# Altium project DIO-SMA16-DIOT.PrjPCB (part 4 of 4)

## Sheet DIOT_SMA_Supply.SchDoc: DIO-SMA
size 420 x 297 mm; Author: G.Kasprowicz; CompanyName: WUT ISE; DrawnBy: G.Kasprowicz; Organization: WUT ISE; Address1: PW ISE; Address2: Nowowiejska 15/19 00-665 Warsaw; Address3: gkasprow@gmail.com; DocumentNumber: 2; Revision: 1.1; SheetNumber: 2; SheetTotal: 2; ModifiedBy: -; CheckedDate: -; Title2: v1.1; DivGrp: WUT ISE; Designer: G.Kasprowicz; ModifiedDate: -; ProjectName: Sensor Box
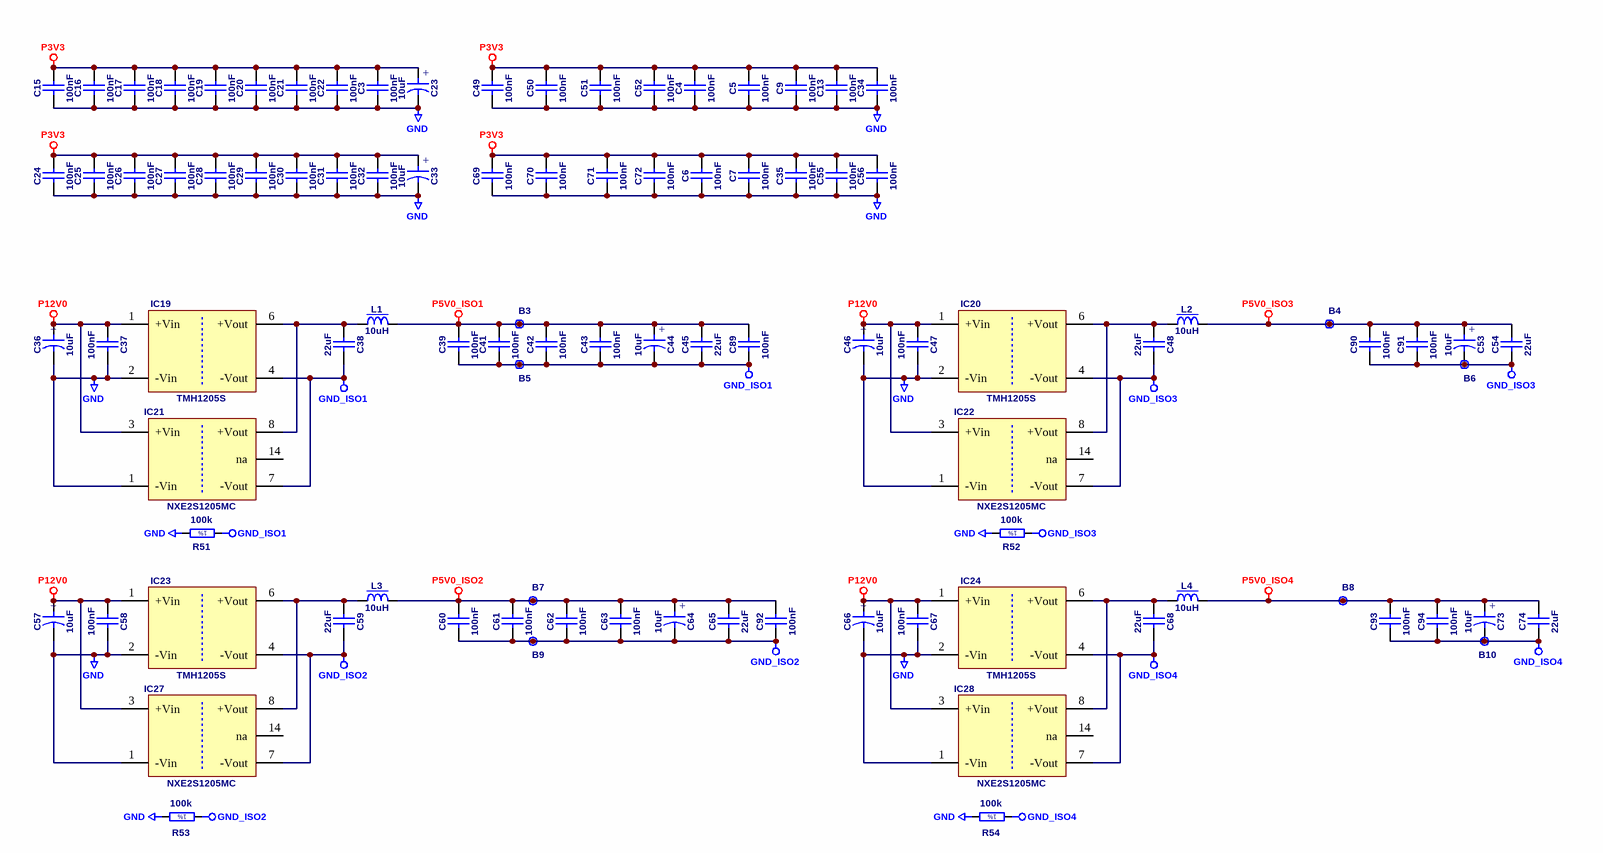
[diagram p9: DIOT_SMA_Supply.SchDoc]

### Parts
B3  Plated Hole  [c130h60]  (value not drawn)  (no BOM)
B4  Plated Hole  [c130h60]  (value not drawn)  (no BOM)
B5  Plated Hole  [c130h60]  (value not drawn)  (no BOM)
B6  Plated Hole  [c130h60]  (value not drawn)  (no BOM)
B7  Plated Hole  [c130h60]  (value not drawn)  (no BOM)
B8  Plated Hole  [c130h60]  (value not drawn)  (no BOM)
B9  Plated Hole  [c130h60]  (value not drawn)  (no BOM)
B10  Plated Hole  [c130h60]  (value not drawn)  (no BOM)
C3  100nF  [CAPC1005X55N]
C4  100nF  [CAPC1005X55N]
C5  100nF  [CAPC1005X55N]
C6  100nF  [CAPC1005X55N]
C7  100nF  [CAPC1005X55N]
C9  100nF  [CAPC1005X55N]
C13  100nF  [CAPC1005X55N]
C15  100nF  [CAPC1005X55N]
C16  100nF  [CAPC1005X55N]
C17  100nF  [CAPC1005X55N]
C18  100nF  [CAPC1005X55N]
C19  100nF  [CAPC1005X55N]
C20  100nF  [CAPC1005X55N]
C21  100nF  [CAPC1005X55N]
C22  100nF  [CAPC1005X55N]
C23  10uF  [CAPAE430X540N]
C24  100nF  [CAPC1005X55N]
C25  100nF  [CAPC1005X55N]
C26  100nF  [CAPC1005X55N]
C27  100nF  [CAPC1005X55N]
C28  100nF  [CAPC1005X55N]
C29  100nF  [CAPC1005X55N]
C30  100nF  [CAPC1005X55N]
C31  100nF  [CAPC1005X55N]
C32  100nF  [CAPC1005X55N]
C33  10uF  [CAPAE430X540N]
C34  100nF  [CAPC1005X55N]
C35  100nF  [CAPC1005X55N]
C36  10uF  [CAPAE430X540N]
C37  100nF  [CAPC1005X55N]
C38  22uF  [CAPC2012X135N]
C39  100nF  [CAPC1005X55N]
C41  100nF  [CAPC1005X55N]
C42  100nF  [CAPC1005X55N]
C43  100nF  [CAPC1005X55N]
C44  10uF  [CAPAE430X540N]
C45  22uF  [CAPC2012X135N]
C46  10uF  [CAPAE430X540N]
C47  100nF  [CAPC1005X55N]
C48  22uF  [CAPC2012X135N]
C49  100nF  [CAPC1005X55N]
C50  100nF  [CAPC1005X55N]
C51  100nF  [CAPC1005X55N]
C52  100nF  [CAPC1005X55N]
C53  10uF  [CAPAE430X540N]
C54  22uF  [CAPC2012X135N]
C55  100nF  [CAPC1005X55N]
C56  100nF  [CAPC1005X55N]
C57  10uF  [CAPAE430X540N]
C58  100nF  [CAPC1005X55N]
C59  22uF  [CAPC2012X135N]
C60  100nF  [CAPC1005X55N]
C61  100nF  [CAPC1005X55N]
C62  100nF  [CAPC1005X55N]
C63  100nF  [CAPC1005X55N]
C64  10uF  [CAPAE430X540N]
C65  22uF  [CAPC2012X135N]
C66  10uF  [CAPAE430X540N]
C67  100nF  [CAPC1005X55N]
C68  22uF  [CAPC2012X135N]
C69  100nF  [CAPC1005X55N]
C70  100nF  [CAPC1005X55N]
C71  100nF  [CAPC1005X55N]
C72  100nF  [CAPC1005X55N]
C73  10uF  [CAPAE430X540N]
C74  22uF  [CAPC2012X135N]
C89  100nF  [CAPC1005X55N]
C90  100nF  [CAPC1005X55N]
C91  100nF  [CAPC1005X55N]
C92  100nF  [CAPC1005X55N]
C93  100nF  [CAPC1005X55N]
C94  100nF  [CAPC1005X55N]
IC19  TMH1205S  [DCDC_TRACO_TMA]
IC20  TMH1205S  [DCDC_TRACO_TMA]
IC21  NXE2S1205MC  [DCDC_MURATA_NXE2]
IC22  NXE2S1205MC  [DCDC_MURATA_NXE2]
IC23  TMH1205S  [DCDC_TRACO_TMA]
IC24  TMH1205S  [DCDC_TRACO_TMA]
IC27  NXE2S1205MC  [DCDC_MURATA_NXE2]
IC28  NXE2S1205MC  [DCDC_MURATA_NXE2]
L1  10uH  [IND_MURATA-PS_8400]
L2  10uH  [IND_MURATA-PS_8400]
L3  10uH  [IND_MURATA-PS_8400]
L4  10uH  [IND_MURATA-PS_8400]
R51  100k  [RESC2012X60N]
R52  100k  [RESC2012X60N]
R53  100k  [RESC2012X60N]
R54  100k  [RESC2012X60N]

### Nets
GND: C3.1 C4.1 C5.1 C6.1 C7.1 C9.1 C13.1 C15.1 C16.1 C17.1 C18.1 C19.1 C20.1 C21.1 C22.1 C23.2 C24.1 C25.1 C26.1 C27.1 C28.1 C29.1 C30.1 C31.1 C32.1 C33.2 C34.1 C35.1 C36.2 C37.1 C46.2 C47.1 C49.1 C50.1 C51.1 C52.1 C55.1 C56.1 C57.2 C58.1 C66.2 C67.1 C69.1 C70.1 C71.1 C72.1 IC19.2(-Vin) IC20.2(-Vin) IC21.1(-Vin) IC22.1(-Vin) IC23.2(-Vin) IC24.2(-Vin) IC27.1(-Vin) IC28.1(-Vin) R51.2 R52.2 R53.2 R54.2
GND_ISO1: B5.1 C38.1 C39.1 C41.1 C42.1 C43.1 C44.2 C45.1 C89.1 IC19.4(-Vout) IC21.7(-Vout) R51.1
GND_ISO2: B9.1 C59.1 C60.1 C61.1 C62.1 C63.1 C64.2 C65.1 C92.1 IC23.4(-Vout) IC27.7(-Vout) R53.1
GND_ISO3: B6.1 C48.1 C53.2 C54.1 C90.1 C91.1 IC20.4(-Vout) IC22.7(-Vout) R52.1
GND_ISO4: B10.1 C68.1 C73.2 C74.1 C93.1 C94.1 IC24.4(-Vout) IC28.7(-Vout) R54.1
P3V3: C3.2 C4.2 C5.2 C6.2 C7.2 C9.2 C13.2 C15.2 C16.2 C17.2 C18.2 C19.2 C20.2 C21.2 C22.2 C23.1 C24.2 C25.2 C26.2 C27.2 C28.2 C29.2 C30.2 C31.2 C32.2 C33.1 C34.2 C35.2 C49.2 C50.2 C51.2 C52.2 C55.2 C56.2 C69.2 C70.2 C71.2 C72.2
P5V0_ISO1: B3.1 C39.2 C41.2 C42.2 C43.2 C44.1 C45.2 C89.2 L1.1
P5V0_ISO2: B7.1 C60.2 C61.2 C62.2 C63.2 C64.1 C65.2 C92.2 L3.1
P5V0_ISO3: B4.1 C53.1 C54.2 C90.2 C91.2 L2.1
P5V0_ISO4: B8.1 C73.1 C74.2 C93.2 C94.2 L4.1
P12V0: C36.1 C37.2 C46.1 C47.2 C57.1 C58.2 C66.1 C67.2 IC19.1(+Vin) IC20.1(+Vin) IC21.3(+Vin) IC22.3(+Vin) IC23.1(+Vin) IC24.1(+Vin) IC27.3(+Vin) IC28.3(+Vin)
NetC38_2: C38.2 IC19.6(+Vout) IC21.8(+Vout) L1.2
NetC48_2: C48.2 IC20.6(+Vout) IC22.8(+Vout) L2.2
NetC59_2: C59.2 IC23.6(+Vout) IC27.8(+Vout) L3.2
NetC68_2: C68.2 IC24.6(+Vout) IC28.8(+Vout) L4.2

Not connected (* = marked no-connect by the designer): IC21 14(na); IC22 14(na); IC27 14(na); IC28 14(na)

### Notes on the sheet
- Project/Equipment
- Document
- Designer
- Drawn by
- Check.by
- Copyright WUT ISE 2020.
  This documentation describes Open Hardware and is licensed under the CERN OHL v.1.2. You may redistribute and modify this documentation under the terms of the CERN OHL v.1.2. (http://ohwr.org/CERNOHL). This documentation is distributed WITHOUT ANY EXPRESS OR IMPLIED WARRANTY, INCLUDING OF MERCHANTABILITY, SATISFACTORY QUALITY AND FITNESS FOR A PARTICULAR PURPOSE. Please see the CERN OHL v.1.2 for applicable conditions.
- Contact
- File
- Last Mod.
- Print Date
- Sheet
- Size
- A3
- of
- Rev
- (in symbol CAE430-540_10UF_16V_20%) +
- (in symbol R0805_100K_1%_0.125W_100PPM) 1%

### Library data of the parts
B3-B10 = PLATED_HOLE0.6_PAD1.3: Single Terminal Socket; Part Description: Plated Through Hole: Hole Dia.=0.6mm Pad Dia.=1.3mm; Mounted: No; Part Number: PLATED_HOLE0.6_PAD1.3; Component Type: Standard (No BOM); Pin Count: 1; Family: Plated Hole; Socket: No; SMD: No; Sense: No; Status: None; ComponentHeight: 0mm; HelpURL: Undefined; Author: CERN DEM MR; CreateDate: 02.03.2016; LatestRevisionDate: 02.03.2016; PackageDescription: Plated Through Hole: Hole Dia.=0.6mm Pad Dia.=1.3mm
C3-C7 C9 C13 C15-C22 C24-C32 C34 C35 C37 C39 C41-C43 C47 C49-C52 C55 C56 C58 C60-C63 C67 C69-C72 C89-C94 = CC0402_100NF_16V_10%_X5R: as C75-C78 on sheet DIOT_SMA_BASE; Part Number: CC0402_100NF_16V_10%_X5R; Component Kind: Standard; Component Type: Standard; Pin Count: 2; Value: 100nF; Status: None; Manufacturer Part Number: CC0402_100NF_16V_10%_X5R; Case: 0402; Mounted: Yes; Socket: No; SMD: Yes; Sense: No; Manufacturer1 Example: MURATA; Manufacturer1 ComponentHeight: 0.55mm; HelpURL: \\cern.ch\dfs\Applications\Altium\Datasheets\CC0402_X5R_MURATA_GRM.pdf; Author: CERN DEM JLC; CreateDate: 10.12.2013; LatestRevisionDate: 10.12.2013
C23 C33 C36 C44 C46 C53 C57 C64 C66 C73 = CAE430-540_10UF_16V_20%: Polarised capacitor; Part Description: Aluminum Electrolytic SMT Capacitor; Manufacturer: PANASONIC; Manufacturer Part Number: EEEFK1C100AR; Voltage: 16V; Tolerance: ±20%; Part Number: CAE430-540_10UF_16V_20%; Component Kind: Standard; Component Type: Standard; Pin Count: 2; Value: 10uF; Status: Not Recommended; Case: B; Mounted: Yes; Socket: No; SMD: Yes; Sense: No; ComponentHeight: 5.8mm; HelpURL: \\cern.ch\dfs\Applications\Altium\Datasheets\CAE_PANASONIC_FK.pdf; Author: CERN DEM JLC; CreateDate: 03.12.2007; LatestRevisionDate: 05.11.2014
C38 C45 C48 C54 C59 C65 C68 C74 = CC0805_22UF_16V_10%_X5R: Non-polarised capacitor; Part Description: SMD Multilayer Chip Ceramic Capacitor; Manufacturer: GENERIC; Manufacturer1 Part Number: C2012X5R1C226KT; Voltage: 16V; TC: X5R; Tolerance: ±10%; Part Number: CC0805_22UF_16V_10%_X5R; Component Kind: Standard; Component Type: Standard; Pin Count: 2; Value: 22uF; Status: Preferred; Manufacturer Part Number: CC0805_22UF_16V_10%_X5R; Case: 0805; Mounted: Yes; Socket: No; SMD: Yes; Sense: No; Manufacturer1 Example: TDK; Manufacturer1 ComponentHeight: 1.35mm; HelpURL: \\cern.ch\dfs\Applications\Altium\Datasheets\CC0805_X5R_TDK_C.pdf; Author: CERN DEM JLC; CreateDate: 25.10.2012; LatestRevisionDate: 25.10.2012
IC19 IC20 IC23 IC24 = DC/DC_TRACO_TMH1205S: 12V ±10% to 5V, Iout (max) 400mA, 2W DC-DC Converter; Manufacturer: TRACO POWER; PressFit: No; Bonding: No; Part Number: TMH1205S; Component Kind: Standard; Component Type: Standard; Device: TMH1205S; PackageDescription: TMA Series, Body 19.5x6.1mm, SIP-6, Unregulated; Part Description: 12V ±10% to 5V, Iout (max) 400mA, 2W DC-DC Converter; Manufacturer Part Number: TMH1205S; Pin Count: 4; Mounted: Yes; Socket: No; SMD: No; Sense: No; ComponentHeight: 10.45mm; HelpURL: \\cern.ch\dfs\Applications\Altium\Datasheets\TMA 0505S.pdf; Author: GK; CreateDate: 17.12.2016; LatestRevisionDate: 17.12.2016
IC21 IC22 IC27 IC28 = DCDC_MURATA_NXE2S1205MC: MURATA, NXE2 Serie, Dual Output DCDC Converter; Part Description: 12V to 5V, Iout (max) 400mA, 3kVDC Isolated, 2W Dual Output DC-DC Converter; Manufacturer: MURATA POWER SOLUTIONS; PressFit: No; Bonding: No; Part Number: NXE2S1205MC; Component Kind: Standard; Component Type: Standard; Device: NXE2S1205MC; PackageDescription: NXE2 Series, Body 12.7 x 10.4, Height 4.4mm; Manufacturer Part Number: NXE2S1205MC; Pin Count: 5; Mounted: Yes; Socket: No; SMD: Yes; Sense: No; ComponentHeight: 4.4mm; HelpURL: \\cern.ch\dfs\Applications\Altium\Datasheets\MTU1D1215MC.pdf; Author: CERN DEM MR; CreateDate: 16.01.2017; LatestRevisionDate: 16.01.2017
L1-L4 = IND_10UH_10%_MURATA-PS_8400: Inductor With Core; Part Description: Miniature Surface Mount Power Inductor (8400 Serie); Manufacturer: MURATA POWER SOLUTIONS; Manufacturer Part Number: 84103C; Power: 950mA; Resistance: 0.24R; Tolerance: ±10%; Part Number: IND_10UH_10%_MURATA-PS_8400; Component Kind: Standard; Component Type: Standard; Pin Count: 2; Value: 10uH; Status: None; Mounted: Yes; Socket: No; SMD: Yes; Sense: No; ComponentHeight: 2.9mm; HelpURL: \\cern.ch\dfs\Applications\Altium\Datasheets\IND_MURATA-PS_8400.pdf; Author: CERN DEM JLC; CreateDate: 02.07.2012; LatestRevisionDate: 02.07.2012
R51-R54 = R0805_100K_1%_0.125W_100PPM: Resistor - 1%; Part Description: General Purpose Thick Film Chip Resistor; Manufacturer: GENERIC; Manufacturer1 Part Number: NRC10F1003TRF; Power: 0.125W; TC: ±100ppm/°C; PressFit: No; Part Number: R0805_100K_1%_0.125W_100PPM; Component Kind: Standard; Component Type: Standard; Pin Count: 2; Value: 100k; Status: Preferred; Tolerance: ±1%; Manufacturer Part Number: R0805_100K_1%_0.125W_100PPM; Case: 0805; Mounted: Yes; Sense: No; Socket: No; SMD: Yes; Manufacturer1 Example: NIC COMPONENT; Manufacturer1 ComponentHeight: 0.6mm; HelpURL: \\cern.ch\dfs\Applications\Altium\Datasheets\R0805_NIC_NRC.pdf; Author: CERN DEM JLC; CreateDate: 03.12.2007; LatestRevisionDate: 13.03.2008

## Nets that join several sheets
GND: DIOT_SMA16 (C212.2 R119.2 R126.2), Power_Supplies (27 pins), CPCIS_Connectors_P1_P6 (67 pins), EEM_Connectors (41 pins), DIOT_SMA_BASE (43 pins), DIOT_SMA_EXT (43 pins), DIOT_SMA_Supply (58 pins)
GND_ISO1: DIOT_SMA_BASE (43 pins), DIOT_SMA_Supply (12 pins)
GND_ISO2: DIOT_SMA_BASE (43 pins), DIOT_SMA_Supply (12 pins)
GND_ISO3: DIOT_SMA_EXT (14 pins), DIOT_SMA_Supply (9 pins)
GND_ISO4: DIOT_SMA_EXT (14 pins), DIOT_SMA_Supply (9 pins)
P3V3: Power_Supplies (5 pins), EEM_Connectors (C298.2 IC40.14), DIOT_SMA_BASE (34 pins), DIOT_SMA_EXT (34 pins), DIOT_SMA_Supply (38 pins)
P3V3_DIOT: Power_Supplies (C102.1 D11.2 IC14.5), CPCIS_Connectors_P1_P6 (14 pins)
P3V3_MP: Power_Supplies (5 pins), EEM_Connectors (5 pins), DIOT_SMA_BASE (C88.2 IC38.2 IC38.3 IC38.16), DIOT_SMA_EXT (5 pins)
P5V0_ISO1: DIOT_SMA_BASE (17 pins), DIOT_SMA_Supply (9 pins)
P5V0_ISO2: DIOT_SMA_BASE (17 pins), DIOT_SMA_Supply (9 pins)
P5V0_ISO3: DIOT_SMA_EXT (8 pins), DIOT_SMA_Supply (6 pins)
P5V0_ISO4: DIOT_SMA_EXT (8 pins), DIOT_SMA_Supply (6 pins)
P12V0: Power_Supplies (10 pins), EEM_Connectors (8 pins), DIOT_SMA_Supply (16 pins)
P12V0_DIOT: Power_Supplies (C40.2 IC14.1 IC14.3), CPCIS_Connectors_P1_P6 (7 pins), EEM_Connectors (R257.1 R260.1 R261.1 R262.1)
BP_I2C.SCL: CPCIS_Connectors_P1_P6 (D5.3 IC1.8 IC1.11 J6.B2), EEM_Connectors (R77.1)
BP_I2C.SDA: CPCIS_Connectors_P1_P6 (D5.1 IC1.1 IC1.4 J6.C2), EEM_Connectors (R3.1)
BP_IO.LVDS_N0: CPCIS_Connectors_P1_P6 (J6.E3), EEM_Connectors (R161.1)
BP_IO.LVDS_N1: CPCIS_Connectors_P1_P6 (J6.B3), EEM_Connectors (R162.1)
BP_IO.LVDS_N2: CPCIS_Connectors_P1_P6 (J6.C4), EEM_Connectors (R163.1)
BP_IO.LVDS_N3: CPCIS_Connectors_P1_P6 (J6.L4), EEM_Connectors (R164.1)
BP_IO.LVDS_N4: CPCIS_Connectors_P1_P6 (J6.I4), EEM_Connectors (R167.1)
BP_IO.LVDS_N5: CPCIS_Connectors_P1_P6 (J6.K5), EEM_Connectors (R168.1)
BP_IO.LVDS_N6: CPCIS_Connectors_P1_P6 (J6.H5), EEM_Connectors (R169.1)
BP_IO.LVDS_N7: CPCIS_Connectors_P1_P6 (J6.F6), EEM_Connectors (R170.1)
BP_IO.LVDS_N8: CPCIS_Connectors_P1_P6 (J6.C6), EEM_Connectors (R171.1)
BP_IO.LVDS_N9: CPCIS_Connectors_P1_P6 (J6.L6), EEM_Connectors (R172.1)
BP_IO.LVDS_N10: CPCIS_Connectors_P1_P6 (J6.I6), EEM_Connectors (R173.1)
BP_IO.LVDS_N11: CPCIS_Connectors_P1_P6 (J7.E1), EEM_Connectors (R174.1)
BP_IO.LVDS_N12: CPCIS_Connectors_P1_P6 (J7.B1), EEM_Connectors (R175.1)
BP_IO.LVDS_N13: CPCIS_Connectors_P1_P6 (J7.K1), EEM_Connectors (R176.1)
BP_IO.LVDS_N14: CPCIS_Connectors_P1_P6 (J7.H1), EEM_Connectors (R177.1)
BP_IO.LVDS_N15: CPCIS_Connectors_P1_P6 (J6.F2), EEM_Connectors (R144.1)
BP_IO.LVDS_P0: CPCIS_Connectors_P1_P6 (J6.D3), EEM_Connectors (R145.1)
BP_IO.LVDS_P1: CPCIS_Connectors_P1_P6 (J6.A3), EEM_Connectors (R146.1)
BP_IO.LVDS_P2: CPCIS_Connectors_P1_P6 (J6.B4), EEM_Connectors (R147.1)
BP_IO.LVDS_P3: CPCIS_Connectors_P1_P6 (J6.K4), EEM_Connectors (R148.1)
BP_IO.LVDS_P4: CPCIS_Connectors_P1_P6 (J6.H4), EEM_Connectors (R149.1)
BP_IO.LVDS_P5: CPCIS_Connectors_P1_P6 (J6.J5), EEM_Connectors (R150.1)
BP_IO.LVDS_P6: CPCIS_Connectors_P1_P6 (J6.G5), EEM_Connectors (R151.1)
BP_IO.LVDS_P7: CPCIS_Connectors_P1_P6 (J6.E6), EEM_Connectors (R152.1)
BP_IO.LVDS_P8: CPCIS_Connectors_P1_P6 (J6.B6), EEM_Connectors (R57.1)
BP_IO.LVDS_P9: CPCIS_Connectors_P1_P6 (J6.K6), EEM_Connectors (R178.1)
BP_IO.LVDS_P10: CPCIS_Connectors_P1_P6 (J6.H6), EEM_Connectors (R180.1)
BP_IO.LVDS_P11: CPCIS_Connectors_P1_P6 (J7.D1), EEM_Connectors (R156.1)
BP_IO.LVDS_P12: CPCIS_Connectors_P1_P6 (J7.A1), EEM_Connectors (R157.1)
BP_IO.LVDS_P13: CPCIS_Connectors_P1_P6 (J7.J1), EEM_Connectors (R158.1)
BP_IO.LVDS_P14: CPCIS_Connectors_P1_P6 (J7.G1), EEM_Connectors (R159.1)
BP_IO.LVDS_P15: CPCIS_Connectors_P1_P6 (J6.E2), EEM_Connectors (R143.1)
EEM0_I2C.SCL: Power_Supplies (IC33.2), EEM_Connectors (5 pins), DIOT_SMA_BASE (IC38.14), DIOT_SMA_EXT (R45.1)
EEM0_I2C.SDA: Power_Supplies (IC33.1), EEM_Connectors (5 pins), DIOT_SMA_BASE (IC38.15), DIOT_SMA_EXT (R44.1)
EEM1_I2C.SCL: EEM_Connectors (D8.6 IC26.6 IC43.6 J9.27), DIOT_SMA_EXT (R49.1)
EEM1_I2C.SDA: EEM_Connectors (D8.4 IC26.5 IC43.5 J9.26), DIOT_SMA_EXT (R47.1)
EEM_IO.LVDS_N5: EEM_Connectors (J8.18 R168.2), DIOT_SMA_EXT (IC3.10 R13.2)
EEM_IO.LVDS_N6: EEM_Connectors (J8.21 R169.2), DIOT_SMA_BASE (IC32.14 R82.2)
EEM_IO.LVDS_N7: EEM_Connectors (J8.24 R170.2), DIOT_SMA_EXT (IC3.14 R15.2)
EEM_IO.LVDS_N8: EEM_Connectors (J9.3 R171.2), DIOT_SMA_BASE (IC46.48 R106.2)
EEM_IO.LVDS_N9: EEM_Connectors (J9.6 R172.2), DIOT_SMA_EXT (IC13.48 R27.2)
EEM_IO.LVDS_N10: EEM_Connectors (J9.9 R173.2), DIOT_SMA_BASE (IC46.4 R114.2)
EEM_IO.LVDS_N11: EEM_Connectors (J9.12 R174.2), DIOT_SMA_EXT (IC13.4 R31.2)
EEM_IO.LVDS_N12: EEM_Connectors (J9.15 R175.2), DIOT_SMA_BASE (IC46.10 R121.2)
EEM_IO.LVDS_N13: EEM_Connectors (J9.18 R176.2), DIOT_SMA_EXT (IC13.10 R36.2)
EEM_IO.LVDS_N14: EEM_Connectors (J9.21 R177.2), DIOT_SMA_BASE (IC46.14 R129.2)
EEM_IO.LVDS_N15: EEM_Connectors (J9.24 R144.2), DIOT_SMA_EXT (IC13.14 R42.2)
EEM_IO.LVDS_P5: EEM_Connectors (J8.17 R150.2), DIOT_SMA_EXT (IC3.9 R13.1)
EEM_IO.LVDS_P6: EEM_Connectors (J8.20 R151.2), DIOT_SMA_BASE (IC32.13 R82.1)
EEM_IO.LVDS_P7: EEM_Connectors (J8.23 R152.2), DIOT_SMA_EXT (IC3.13 R15.1)
EEM_IO.LVDS_P8: EEM_Connectors (J9.2 R57.2), DIOT_SMA_BASE (IC46.47 R106.1)
EEM_IO.LVDS_P9: EEM_Connectors (J9.5 R178.2), DIOT_SMA_EXT (IC13.47 R27.1)
EEM_IO.LVDS_P10: EEM_Connectors (J9.8 R180.2), DIOT_SMA_BASE (IC46.3 R114.1)
EEM_IO.LVDS_P11: EEM_Connectors (J9.11 R156.2), DIOT_SMA_EXT (IC13.3 R31.1)
EEM_IO.LVDS_P12: EEM_Connectors (J9.14 R157.2), DIOT_SMA_BASE (IC46.9 R121.1)
EEM_IO.LVDS_P13: EEM_Connectors (J9.17 R158.2), DIOT_SMA_EXT (IC13.9 R36.1)
EEM_IO.LVDS_P14: EEM_Connectors (J9.20 R159.2), DIOT_SMA_BASE (IC46.13 R129.1)
EEM_IO.LVDS_P15: EEM_Connectors (J9.23 R143.2), DIOT_SMA_EXT (IC13.13 R42.1)
LVDS_DUAL_N0: EEM_Connectors (J8.3 R161.2), DIOT_SMA_BASE (IC32.48 R64.2)
LVDS_DUAL_N1: EEM_Connectors (J8.6 R162.2), DIOT_SMA_EXT (IC3.48 R6.2)
LVDS_DUAL_N2: EEM_Connectors (J8.9 R163.2), DIOT_SMA_BASE (IC32.4 R71.2)
LVDS_DUAL_N3: EEM_Connectors (J8.12 R164.2), DIOT_SMA_EXT (IC3.4 R12.2)
LVDS_DUAL_N4: EEM_Connectors (J8.15 R167.2), DIOT_SMA_BASE (IC32.10 R76.2)
LVDS_DUAL_P0: EEM_Connectors (J8.2 R145.2), DIOT_SMA_BASE (IC32.47 R64.1)
LVDS_DUAL_P1: EEM_Connectors (J8.5 R146.2), DIOT_SMA_EXT (IC3.47 R6.1)
LVDS_DUAL_P2: EEM_Connectors (J8.8 R147.2), DIOT_SMA_BASE (IC32.3 R71.1)
LVDS_DUAL_P3: EEM_Connectors (J8.11 R148.2), DIOT_SMA_EXT (IC3.3 R12.1)
LVDS_DUAL_P4: EEM_Connectors (J8.14 R149.2), DIOT_SMA_BASE (IC32.9 R76.1)
PGOOD: Power_Supplies (IC17.7), CPCIS_Connectors_P1_P6 (R40.1 T2.1)
PSU_EN: Power_Supplies (IC17.8 R187.1 R188.2), CPCIS_Connectors_P1_P6 (R33.2)
SERVMOD_3V3: CPCIS_Connectors_P1_P6 (R1.2 R138.1), EEM_Connectors (IC40.5 IC40.13)

## Assembly variants
EEM: not fitted C1 C2 C9 C11 C14 C16 C17 C29 C30 C44 C46 C47 C48 C49 C50 C51 C94 C95 C96 C111 C114 C154 C155 C165 C166 C167 C192 C201 C202 C213 C214 C217 C218 C286 C305 D5 D6 D7 D9 IC3 IC5 IC6 IC7 IC13 IC35 IC37 IC38 IC39 J6 J7 J10 L29 R1 R2 R3 R4 R10 R14 R17 R18 R22 R36 R38 R39 R40 R41 R73 R74 R75 R77 R94 R114 R115 R117 R127 R128 R129 R130 R131 R132 R133 R134 R135 R136 R137 R138 R139 R140 R141 R142 R143 R144 R145 R146 R147 R148 R149 R150 R151 R152 R153 R154 R155 R156 R157 R158 R159 R161 R162 R163 R164 R167 R168 R169 R170 R171 R172 R173 R174 R175 R176 R177 R197 R199 R245 R246 R251 R253 R257 R260 R261 R262 R263 R264 R265 R266 R270 R271 R274 R275 R276 R277 R279 R280 R281 R282 R283 T15 T17; alternate parts R126 -> R0805_0R_JUMPER
DIOT: not fitted C1 C2 C9 C11 C14 C16 C17 C29 C30 C44 C94 C95 C96 C111 C114 C192 C201 C202 C213 C214 C217 C218 C220 C262 C263 C264 C286 C305 C307 D8 FL1 IC3 IC13 IC26 IC35 IC37 IC43 J8 J9 J10 J11 L29 R1 R2 R4 R10 R14 R17 R18 R22 R36 R73 R74 R75 R94 R105 R109 R117 R252 R263 R264 R265 R266 R270 R272 R273